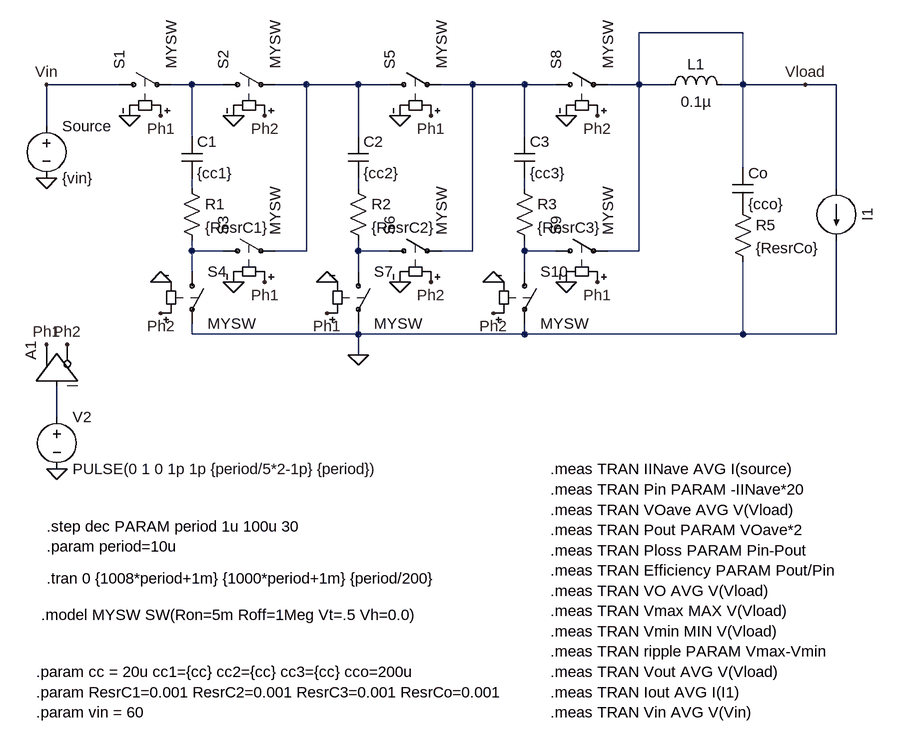
[diagram p0: schematic 5to1_fibonacci_soft.asc]
5to1_fibonacci_soft.asc, the LTspice schematic file:
Version 4
SHEET 1 1688 916
WIRE 368 -304 208 -304
WIRE -592 -224 -704 -224
WIRE -480 -224 -512 -224
WIRE -432 -224 -480 -224
WIRE -304 -224 -352 -224
WIRE -224 -224 -304 -224
WIRE -176 -224 -224 -224
WIRE -48 -224 -96 -224
WIRE 32 -224 -48 -224
WIRE 80 -224 32 -224
WIRE 208 -224 208 -304
WIRE 208 -224 160 -224
WIRE 256 -224 208 -224
WIRE 368 -224 368 -304
WIRE 368 -224 336 -224
WIRE 464 -224 368 -224
WIRE 512 -224 464 -224
WIRE -704 -160 -704 -224
WIRE -480 -144 -480 -224
WIRE -224 -144 -224 -224
WIRE 32 -144 32 -224
WIRE 368 -96 368 -224
WIRE -480 -64 -480 -80
WIRE -224 -64 -224 -80
WIRE 32 -64 32 -80
WIRE 512 -64 512 -224
WIRE -480 32 -480 16
WIRE -432 32 -480 32
WIRE -304 32 -304 -224
WIRE -304 32 -352 32
WIRE -224 32 -224 16
WIRE -176 32 -224 32
WIRE -48 32 -48 -224
WIRE -48 32 -96 32
WIRE 32 32 32 16
WIRE 80 32 32 32
WIRE 208 32 208 -224
WIRE 208 32 160 32
WIRE -480 64 -480 32
WIRE -224 64 -224 32
WIRE 32 64 32 32
WIRE -480 160 -480 144
WIRE -224 160 -224 144
WIRE -224 160 -480 160
WIRE 32 160 32 144
WIRE 32 160 -224 160
WIRE 368 160 368 48
WIRE 368 160 32 160
WIRE 512 160 512 16
WIRE 512 160 368 160
WIRE -224 192 -224 160
WIRE -688 288 -688 240
FLAG -688 368 0
FLAG -704 176 Ph1
FLAG -704 -80 0
FLAG -528 -176 Ph1
FLAG -368 -176 Ph2
FLAG -576 -176 0
FLAG -416 -176 0
FLAG -704 -224 Vin
FLAG 464 -224 Vload
FLAG -672 176 Ph2
FLAG -112 -176 Ph1
FLAG -160 -176 0
FLAG 144 -176 Ph2
FLAG 96 -176 0
FLAG -224 192 0
FLAG -368 80 Ph1
FLAG -272 128 Ph1
FLAG 144 80 Ph1
FLAG -528 128 Ph2
FLAG -112 80 Ph2
FLAG -16 128 Ph2
FLAG -528 80 0
FLAG -416 80 0
FLAG -160 80 0
FLAG -16 80 0
FLAG 96 80 0
FLAG -272 80 0
SYMBOL voltage -688 272 R0
WINDOW 123 0 0 Left 2
WINDOW 39 0 0 Left 2
SYMATTR InstName V2
SYMATTR Value PULSE(0 1 0 1p 1p {period/5*2-1p} {period})
SYMBOL Digital\\buf -752 240 R270
SYMATTR InstName A1
SYMBOL voltage -704 -176 R0
WINDOW 123 0 0 Left 2
WINDOW 39 0 0 Left 2
SYMATTR InstName Source
SYMATTR Value {vin}
SYMBOL sw -608 -224 R270
SYMATTR InstName S1
SYMATTR Value MYSW
SYMBOL sw -448 -224 R270
SYMATTR InstName S2
SYMATTR Value MYSW
SYMBOL cap -496 -144 R0
SYMATTR InstName C1
SYMATTR Value {cc1}
SYMATTR SpiceLine ic = {vin/5*3}
SYMBOL cap 352 -96 R0
SYMATTR InstName Co
SYMATTR Value {cco}
SYMATTR SpiceLine ic = {vin/5}
SYMBOL res -496 -80 R0
SYMATTR InstName R1
SYMATTR Value {ResrC1}
SYMBOL res 352 -48 R0
SYMATTR InstName R5
SYMATTR Value {ResrCo}
SYMBOL current 512 -64 R0
WINDOW 0 32 40 VTop 2
WINDOW 3 96 52 Invisible 2
WINDOW 123 0 0 Left 2
WINDOW 39 0 0 Left 2
SYMATTR InstName I1
SYMATTR Value PULSE(0 2 {10*period} {100*period} 0 10 20 1)
SYMBOL sw -480 48 R0
SYMATTR InstName S4
SYMATTR Value MYSW
SYMBOL sw -448 32 R270
SYMATTR InstName S3
SYMATTR Value MYSW
SYMBOL sw -192 -224 R270
SYMATTR InstName S5
SYMATTR Value MYSW
SYMBOL cap -240 -144 R0
SYMATTR InstName C2
SYMATTR Value {cc2}
SYMATTR SpiceLine ic = {vin/5*2}
SYMBOL res -240 -80 R0
SYMATTR InstName R2
SYMATTR Value {ResrC2}
SYMBOL sw -192 32 R270
SYMATTR InstName S6
SYMATTR Value MYSW
SYMBOL sw 64 -224 R270
SYMATTR InstName S8
SYMATTR Value MYSW
SYMBOL cap 16 -144 R0
SYMATTR InstName C3
SYMATTR Value {cc3}
SYMATTR SpiceLine ic = {vin/5}
SYMBOL res 16 -80 R0
SYMATTR InstName R3
SYMATTR Value {ResrC3}
SYMBOL sw 64 32 R270
SYMATTR InstName S9
SYMATTR Value MYSW
SYMBOL sw -224 48 R0
SYMATTR InstName S7
SYMATTR Value MYSW
SYMBOL sw 32 48 R0
SYMATTR InstName S10
SYMATTR Value MYSW
SYMBOL ind 240 -208 R270
WINDOW 0 32 56 VTop 2
WINDOW 3 5 56 VBottom 2
SYMATTR InstName L1
SYMATTR Value 0.1µ
TEXT -712 592 Left 2 !.model MYSW SW(Ron=5m Roff=1Meg Vt=.5 Vh=0.0)
TEXT 72 368 Left 2 !.meas TRAN IINave AVG I(source)\n.meas TRAN Pin PARAM -IINave*20\n.meas TRAN VOave AVG V(Vload)\n.meas TRAN Pout PARAM VOave*2\n.meas TRAN Ploss PARAM Pin-Pout\n.meas TRAN Efficiency PARAM Pout/Pin\n.meas TRAN VO AVG V(Vload)\n.meas TRAN Vmax MAX V(Vload)\n.meas TRAN Vmin MIN V(Vload)\n.meas TRAN ripple PARAM Vmax-Vmin\n.meas TRAN Vout AVG V(Vload)\n.meas TRAN Iout AVG I(I1)\n.meas TRAN Vin AVG V(Vin)
TEXT -720 680 Left 2 !.param cc = 20u cc1={cc} cc2={cc} cc3={cc} cco=200u\n.param ResrC1=0.001 ResrC2=0.001 ResrC3=0.001 ResrCo=0.001\n.param vin = 60
TEXT -704 536 Left 2 !.tran 0 {1008*period+1m} {1000*period+1m} {period/200}
TEXT -704 456 Left 2 !.step dec PARAM period 1u 100u 30\n.param period=10u

The netlist it stands for:
* 5to1_fibonacci_soft.asc
V2 N010 0 PULSE(0 1 0 1p 1p {period/5*2-1p} {period})
A1 N010 0 0 0 0 Ph2 Ph1 0 BUF
V§Source Vin 0 {vin}
S1 Vin N001 Ph1 0 MYSW
S2 N001 N002 Ph2 0 MYSW
C1 N001 N004 {cc1} ic = {vin/5*3}
Co Vload P001 {cco} ic = {vin/5}
R1 N004 N007 {ResrC1}
R5 P001 0 {ResrCo}
I1 Vload 0 PULSE(0 2 {10*period} {100*period} 0 10 20 1)
S4 N007 0 Ph2 0 MYSW
S3 N007 N002 Ph1 0 MYSW
S5 N002 N003 Ph1 0 MYSW
C2 N002 N005 {cc2} ic = {vin/5*2}
R2 N005 N008 {ResrC2}
S6 N008 N003 Ph2 0 MYSW
S8 N003 Vload Ph2 0 MYSW
C3 N003 N006 {cc3} ic = {vin/5}
R3 N006 N009 {ResrC3}
S9 N009 Vload Ph1 0 MYSW
S7 N008 0 Ph1 0 MYSW
S10 N009 0 Ph2 0 MYSW
L1 Vload Vload 0.1µ
.model MYSW SW(Ron=5m Roff=1Meg Vt=.5 Vh=0.0)
.meas TRAN IINave AVG I(source)
.meas TRAN Pin PARAM -IINave*20
.meas TRAN VOave AVG V(Vload)
.meas TRAN Pout PARAM VOave*2
.meas TRAN Ploss PARAM Pin-Pout
.meas TRAN Efficiency PARAM Pout/Pin
.meas TRAN VO AVG V(Vload)
.meas TRAN Vmax MAX V(Vload)
.meas TRAN Vmin MIN V(Vload)
.meas TRAN ripple PARAM Vmax-Vmin
.meas TRAN Vout AVG V(Vload)
.meas TRAN Iout AVG I(I1)
.meas TRAN Vin AVG V(Vin)
.param cc = 20u cc1={cc} cc2={cc} cc3={cc} cco=200u
.param ResrC1=0.001 ResrC2=0.001 ResrC3=0.001 ResrCo=0.001
.param vin = 60
.tran 0 {1008*period+1m} {1000*period+1m} {period/200}
.step dec PARAM period 1u 100u 30
.param period=10u
.backanno
.end